# EAGLE design power (EAGLE 9.6.2)
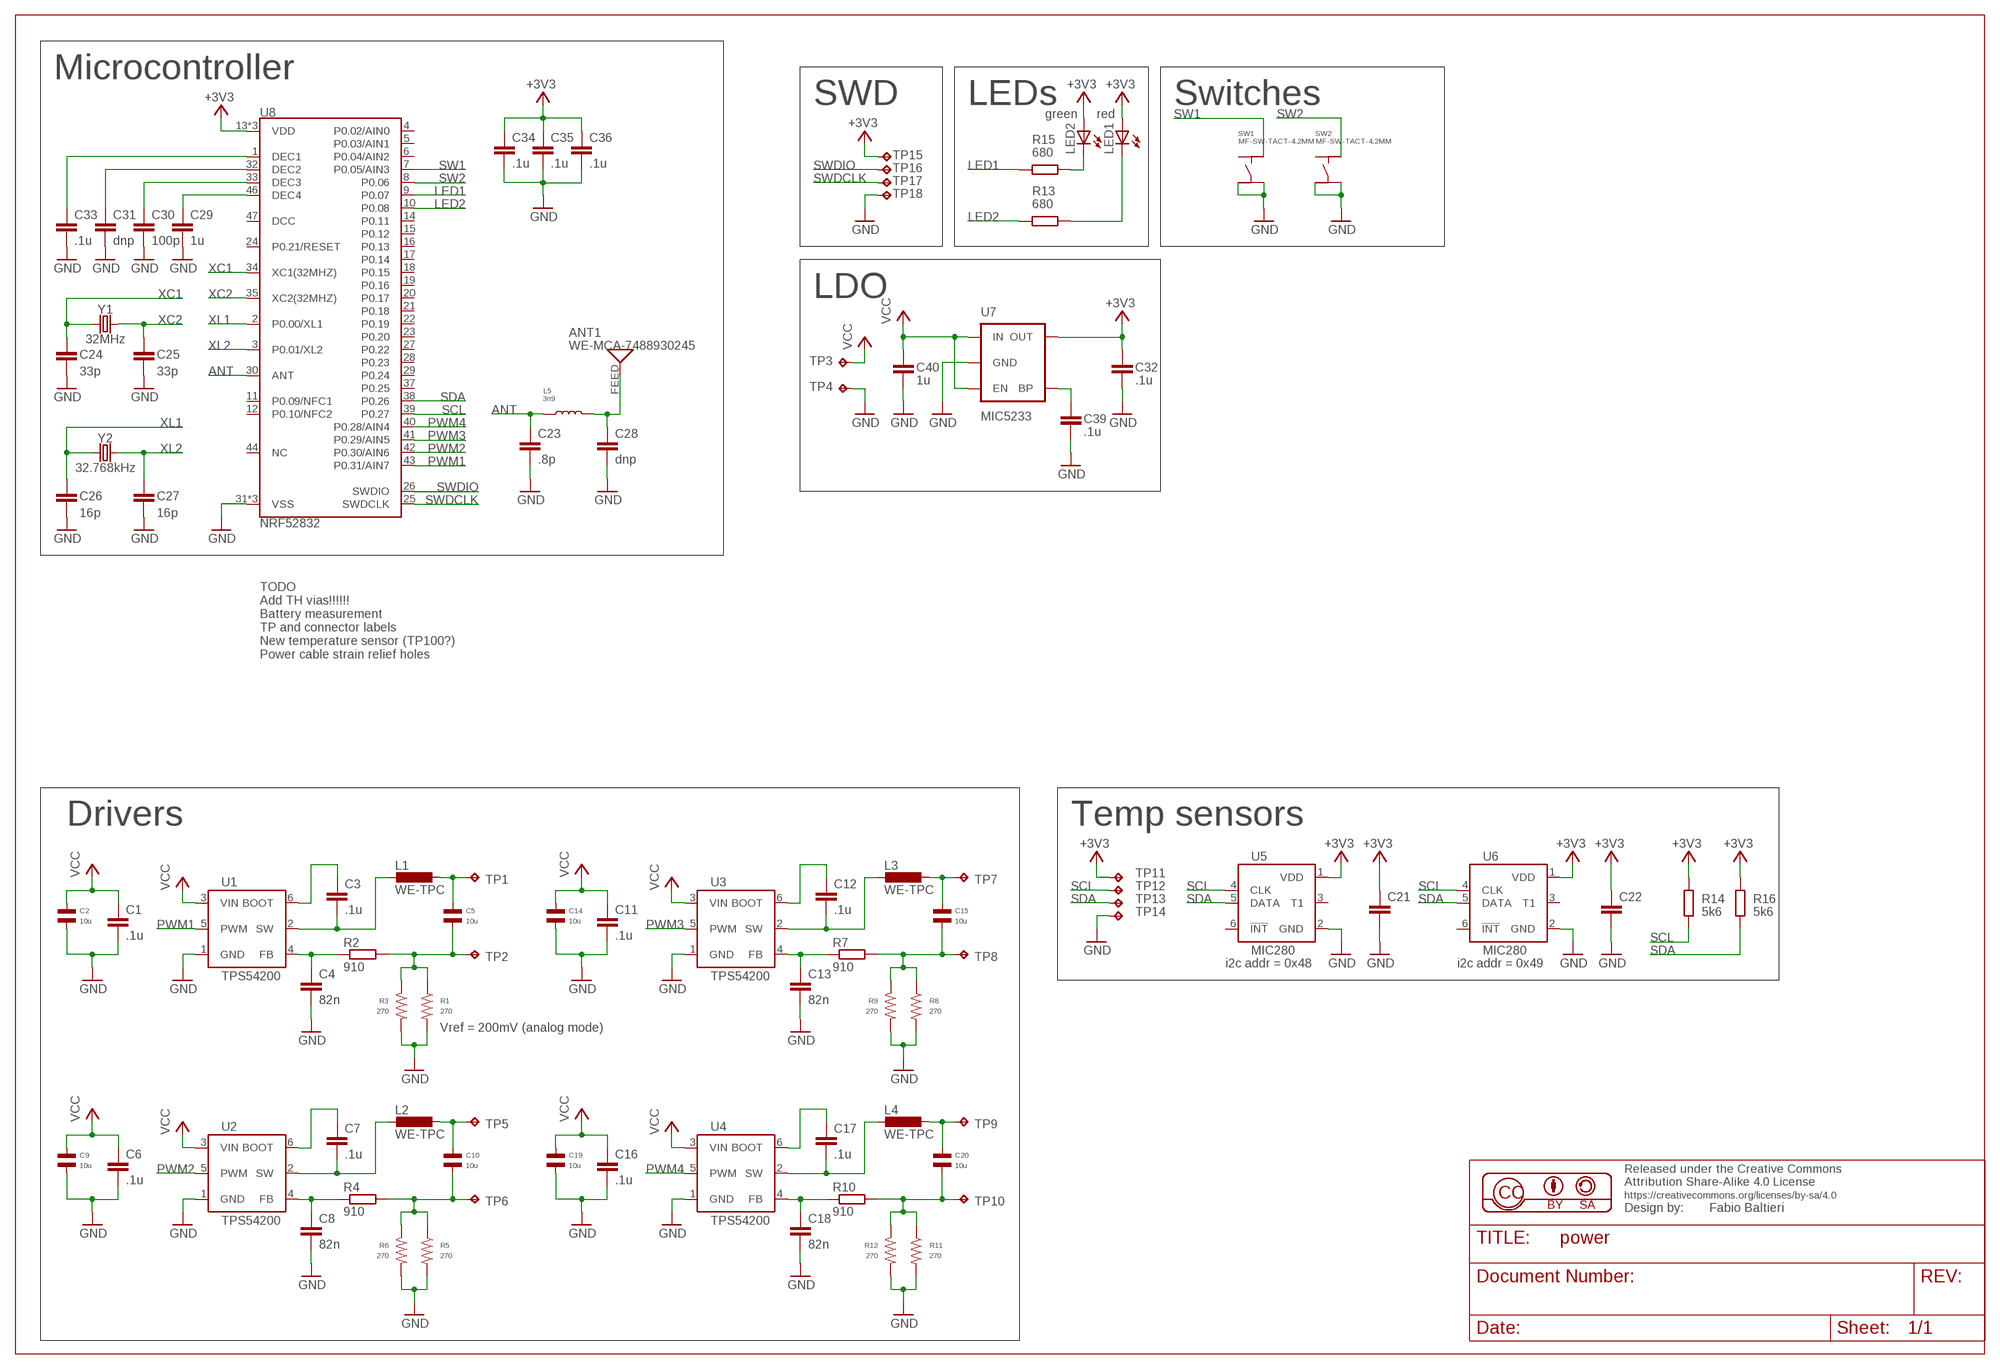
[diagram p0: schematic, sheet 1]

## Parts
ANT1  WE-MCA-7488930245  [WE-MCA]
C1  .1u  C0603  [0603]
C2  10u  CAPACITOR_NP_1206  [C1206]
C3  .1u  C0603  [0603]
C4  82n  C0603  [0603]
C5  10u  CAPACITOR_NP_1206  [C1206]
C6  .1u  C0603  [0603]
C7  .1u  C0603  [0603]
C8  82n  C0603  [0603]
C9  10u  CAPACITOR_NP_1206  [C1206]
C10  10u  CAPACITOR_NP_1206  [C1206]
C11  .1u  C0603  [0603]
C12  .1u  C0603  [0603]
C13  82n  C0603  [0603]
C14  10u  CAPACITOR_NP_1206  [C1206]
C15  10u  CAPACITOR_NP_1206  [C1206]
C16  .1u  C0603  [0603]
C17  .1u  C0603  [0603]
C18  82n  C0603  [0603]
C19  10u  CAPACITOR_NP_1206  [C1206]
C20  10u  CAPACITOR_NP_1206  [C1206]
C21  C0603  [0603]
C22  C0603  [0603]
C23  .8p  C0603  [0603]
C24  33p  C0603  [0603]
C25  33p  C0603  [0603]
C26  16p  C0603  [0603]
C27  16p  C0603  [0603]
C28  dnp  C0603  [0603]
C29  1u  C0603  [0603]
C30  100p  C0603  [0603]
C31  dnp  C0603  [0603]
C32  .1u  C0603  [0603]
C33  .1u  C0603  [0603]
C34  .1u  C0603  [0603]
C35  .1u  C0603  [0603]
C36  .1u  C0603  [0603]
C39  .1u  C0603  [0603]
C40  1u  C0603  [0603]
L1  WE-TPC  [WE-TPC_INDUCTOR]
L2  WE-TPC  [WE-TPC_INDUCTOR]
L3  WE-TPC  [WE-TPC_INDUCTOR]
L4  WE-TPC  [WE-TPC_INDUCTOR]
L5  3n9  INDUCTOR_0603  [L0603]
LED1  LEDSML0805  [SML0805]
LED2  LEDSML0805  [SML0805]
R1  270  RESISTOR_0805  [R0805]
R2  910  R0603  [0603]
R3  270  RESISTOR_0805  [R0805]
R4  910  R0603  [0603]
R5  270  RESISTOR_0805  [R0805]
R6  270  RESISTOR_0805  [R0805]
R7  910  R0603  [0603]
R8  270  RESISTOR_0805  [R0805]
R9  270  RESISTOR_0805  [R0805]
R10  910  R0603  [0603]
R11  270  RESISTOR_0805  [R0805]
R12  270  RESISTOR_0805  [R0805]
R13  680  R0603  [0603]
R14  5k6  R0603  [0603]
R15  680  R0603  [0603]
R16  5k6  R0603  [0603]
SW1  MF-SW-TACT-4.2MM  TACT_4.2MM  [TACT4.2MM]
SW2  MF-SW-TACT-4.2MM  TACT_4.2MM  [TACT4.2MM]
TP1  TPTP18R  [TP18R]
TP2  TPTP18R  [TP18R]
TP3  TPTP18R  [TP18R]
TP4  TPTP18R  [TP18R]
TP5  TPTP18R  [TP18R]
TP6  TPTP18R  [TP18R]
TP7  TPTP18R  [TP18R]
TP8  TPTP18R  [TP18R]
TP9  TPTP18R  [TP18R]
TP10  TPTP18R  [TP18R]
TP11  TPTP14R  [TP14R]
TP12  TPTP14R  [TP14R]
TP13  TPTP14R  [TP14R]
TP14  TPTP14R  [TP14R]
TP15  TPTP12R  [TP12R]
TP16  TPTP12R  [TP12R]
TP17  TPTP12R  [TP12R]
TP18  TPTP12R  [TP12R]
U1  TPS54200  [SOT23-6L]
U2  TPS54200  [SOT23-6L]
U3  TPS54200  [SOT23-6L]
U4  TPS54200  [SOT23-6L]
U5  MIC280  [SOT23-6L]
U6  MIC280  [SOT23-6L]
U7  MIC5233  V_REG_LDOSMD  [SOT23-5]
U8  NRF52832  [QFN48-6X6MM]
Y1  32MHz  CRYSTALSMD-3.2X2.5  [CRYSTAL-SMD-3.2X2.5MM]
Y2  32.768kHz  CRYSTAL-32.768KHZSMD-3.2X1.5  [CRYSTAL-SMD-3.2X1.5MM]

## Nets
+3V3: C21.1 C22.1 C32.1 C34.1 C35.1 C36.1 LED1.A LED2.A R14.1 R16.1 TP11.TP TP15.TP U5.1(VDD) U6.1(VDD) U7.5(OUT) U8.13(VDD) U8.36(VDD) U8.48(VDD)
ANT: C23.1 L5.P$1 U8.30(ANT)
GND: C1.2 C2.P$2 C4.2 C6.2 C8.2 C9.P$2 C11.2 C13.2 C14.P$2 C16.2 C18.2 C19.P$2 C21.2 C22.2 C23.2 C24.2 C25.2 C26.2 C27.2 C28.2 C29.2 C30.2 C31.2 C32.2 C33.2 C34.2 C35.2 C36.2 C39.2 C40.2 R1.P$2 R3.P$2 R5.P$2 R6.P$2 R8.P$2 R9.P$2 R11.P$2 R12.P$2 SW1.P$3 SW1.P$4 SW2.P$3 SW2.P$4 TP4.TP TP14.TP TP18.TP U1.1(GND) U2.1(GND) U3.1(GND) U4.1(GND) U5.2(GND) U6.2(GND) U7.2(GND) U8.31(VSS) U8.45(VSS) U8.EP(VSS)
LED1: R15.2 U8.9(P0.07)
LED2: R13.2 U8.10(P0.08)
N$1: C3.2 L1.P$1 U1.2(SW)
N$2: C3.1 U1.6(BOOT)
N$3: C5.P$1 L1.P$2 TP1.TP
N$4: C4.1 R2.1 U1.4(FB)
N$5: C5.P$2 R1.P$1 R2.2 R3.P$1 TP2.TP
N$6: C7.2 L2.P$1 U2.2(SW)
N$7: C7.1 U2.6(BOOT)
N$8: C8.1 R4.1 U2.4(FB)
N$9: C10.P$2 R4.2 R5.P$1 R6.P$1 TP6.TP
N$10: C10.P$1 L2.P$2 TP5.TP
N$11: C12.2 L3.P$1 U3.2(SW)
N$12: C12.1 U3.6(BOOT)
N$13: C13.1 R7.1 U3.4(FB)
N$14: C15.P$2 R7.2 R8.P$1 R9.P$1 TP8.TP
N$15: C15.P$1 L3.P$2 TP7.TP
N$16: C17.2 L4.P$1 U4.2(SW)
N$17: C17.1 U4.6(BOOT)
N$18: C18.1 R10.1 U4.4(FB)
N$19: C20.P$2 R10.2 R11.P$1 R12.P$1 TP10.TP
N$20: C20.P$1 L4.P$2 TP9.TP
N$21: LED1.C R13.1
N$22: ANT1.FEED C28.1 L5.P$2
N$23: LED2.C R15.1
N$24: C29.1 U8.46(DEC4)
N$25: C30.1 U8.33(DEC3)
N$26: C31.1 U8.32(DEC2)
N$27: C33.1 U8.1(DEC1)
N$30: C39.1 U7.4(BP)
PWM1: U1.5(PWM) U8.43(P0.31/AIN7)
PWM2: U2.5(PWM) U8.42(P0.30/AIN6)
PWM3: U3.5(PWM) U8.41(P0.29/AIN5)
PWM4: U4.5(PWM) U8.40(P0.28/AIN4)
SCL: R14.2 TP12.TP U5.4(CLK) U6.4(CLK) U8.39(P0.27)
SDA: R16.2 TP13.TP U5.5(DATA) U6.5(DATA) U8.38(P0.26)
SW1: SW1.P$2 U8.7(P0.05/AIN3)
SW2: SW2.P$2 U8.8(P0.06)
SWDCLK: TP17.TP U8.25(SWDCLK)
SWDIO: TP16.TP U8.26(SWDIO)
VCC: C1.1 C2.P$1 C6.1 C9.P$1 C11.1 C14.P$1 C16.1 C19.P$1 C40.1 TP3.TP U1.3(VIN) U2.3(VIN) U3.3(VIN) U4.3(VIN) U7.1(IN) U7.3(EN)
XC1: C24.1 U8.34(XC1(32MHZ)) Y1.1
XC2: C25.1 U8.35(XC2(32MHZ)) Y1.3
XL1: C26.1 U8.2(P0.00/XL1) Y2.P$1
XL2: C27.1 U8.3(P0.01/XL2) Y2.P$2
Unconnected: SW1.P$1 SW2.P$1 U5.3(T1) U5.6(!INT) U6.3(T1) U6.6(!INT) U8.4(P0.02/AIN0) U8.5(P0.03/AIN1) U8.6(P0.04/AIN2) U8.11(P0.09/NFC1) U8.12(P0.10/NFC2) U8.14(P0.11) U8.15(P0.12) U8.16(P0.13) U8.17(P0.14) U8.18(P0.15) U8.19(P0.16) U8.20(P0.17) U8.21(P0.18) U8.22(P0.19) U8.23(P0.20) U8.24(P0.21/RESET) U8.27(P0.22) U8.28(P0.23) U8.29(P0.24) U8.37(P0.25) U8.44(NC) U8.47(DCC)

## Notes on the sheet
- Microcontroller
- SWD | LEDs | Switches
- green | red
- LDO
- TODO
  Add TH vias!!!!!!
  Battery measurement
  TP and connector labels
  New temperature sensor (TP100?)
  Power cable strain relief holes
- Drivers | Temp sensors
- i2c addr = 0x48 | i2c addr = 0x49
- Vref = 200mV (analog mode)

## Library data of the parts
ANT1 = balto:WE-MCA: Wurth WE-MCA Multilayer Chip Antenna
C1 C3 C4 C6-C8 C11-C13 C16-C18 C21-C36 C39 C40 = balto:C: Capacitor
C2 C5 C9 C10 C14 C15 C19 C20 = MF_Passives:CAPACITOR_NP: Library: MF_Passives Description: Device for Non-Polarized Capacitors. Manufacture part number (MPN) can be added via Attributes. Check https://factory.macrofab.com/parts for the house parts list.; POPULATE: 1
L1-L4 = balto:WE-TPC: WE-TPC SMD Shielded Tiny PowerInductor
L5 = MF_Passives:INDUCTOR: Library: MF_Passives Description: Device for Inductors. Manufacture part number (MPN) can be added via Attributes. Check https://factory.macrofab.com/parts for the house parts list.; POPULATE: 1
LED1 LED2 = led:LED: LED OSRAM: - CHIPLED LG R971, LG N971, LY N971, LG Q971, LY Q971, LO R971, LY R971 LH N974, LH R974 LS Q976, LO Q976, LY Q976 LO Q996 - Hyper CHIPLED LW Q18S LB Q993, LB Q99A, LB R99A - SideLED LS A670, LO A670, LY A670, LG A670, LP A670 LB A673, LV A673, LT A673, LW A673 LH A674 LY A675 LS A676, LA A676, LO A676, LY A676, LW A676 LS A679, LY A679, LG A679 - Hyper Micro SIDELED® LS Y876, LA Y876, LO Y876, LY Y876 LT Y87S - SmartLED LW L88C, LW L88S LB L89C, LB L89S, LG L890 LS L89K, LO L89K, LY L89K LS L896, LA L896, LO L896, LY L896 - TOPLED LS T670, LO T670, LY T670, LG T670, LP T670 LSG T670, LSP T670, LSY T670, LOP T670, LYG T670 LG T671, LOG T671, LSG T671 LB T673, LV T673, LT T673, LW T673 LH T674 LS T676, LA T676, LO T676, LY T676, LB T676, LH T676, LSB T676, LW T676 LB T67C, LV T67C, LT T67C, LS T67K, LO T67K, LY T67K, LW E67C LS E67B, LA E67B, LO E67B, LY E67B, LB E67C, LV E67C, LT E67C LW T67C LS T679, LY T679, LG T679 LS T770, LO T770, LY T770, LG T770, LP T770 LB T773, LV T773, LT T773, LW T773 LH T774 LS E675, LA E675, LY E675, LS T675 LS T776, LA T776, LO T776, LY T776, LB T776 LHGB T686 LT T68C, LB T68C - Hyper Mini TOPLED® LB M676 - Mini TOPLED Santana® LG M470 LS M47K, LO M47K, LY M47K Source: http://www.osram.convergy.de LUXEON: - LUMILED® LXK2-PW12-R00, LXK2-PW12-S00, LXK2-PW14-U00, LXK2-PW14-V00 LXK2-PM12-R00, LXK2-PM12-S00, LXK2-PM14-U00 LXK2-PE12-Q00, LXK2-PE12-R00, LXK2-PE12-S00, LXK2-PE14-T00, LXK2-PE14-U00 LXK2-PB12-K00, LXK2-PB12-L00, LXK2-PB12-M00, LXK2-PB14-N00, LXK2-PB14-P00, LXK2-PB14-Q00 LXK2-PR12-L00, LXK2-PR12-M00, LXK2-PR14-Q00, LXK2-PR14-R00 LXK2-PD12-Q00, LXK2-PD12-R00, LXK2-PD12-S00 LXK2-PH12-R00, LXK2-PH12-S00 LXK2-PL12-P00, LXK2-PL12-Q00, LXK2-PL12-R00 Source: www.luxeon.com KINGBRIGHT: KA-3528ASYC Source: www.kingbright.com
R1 R3 R5 R6 R8 R9 R11 R12 = MF_Passives:RESISTOR: Library: MF_Passives Description: Device for Resistors. Manufacture part number (MPN), Voltage, Tolerance, and Wattage Rating can be added via Attributes. Check https://factory.macrofab.com/parts for the house parts list.; POPULATE: 1
R2 R4 R7 R10 R13-R16 = balto:R: Resistor
SW1 SW2 = MF_Switches:TACT: Library: MF_Switches Description: Device for Tact Switches. Manufacture part number (MFG#) can be added via Attributes.; HOUSEPART: YES; MPN: MF-SW-TACT-4.2MM; POPULATE: 1; URL: https://factory.macrofab.com/part/MF-SW-TACT-4.2MM
TP1-TP18 = testpad:TP: Test pad
U1-U4 = balto:TPS54200: TPS54200, TPS54201 4.5-V to 28-V Input Voltage, 1.5-A Output Current, Synchronous Buck Mono-Color or IR LED Driver http://www.ti.com/lit/ds/symlink/tps54201.pdf
U5 U6 = balto:MIC280: MIC280 Precision IttyBitty Thermal Supervisor
U7 = SparkFun-PowerIC:V_REG_LDO: Voltage Regulator LDO Standard 150mA LDO voltage regulator in SOT-23 layout. Micrel part MIC5205. BP (by-pass) pin is used to lower output noise with 470pF cap.
U8 = SparkFun-RF:NRF52832: Nordic nRF52832 Bluetooth Smart/ANT/2.4GHz RF SoC The nRF52832 SoC is a powerful, highly flexible ultra-low power multiprotocol SoC ideally suited for Bluetooth® Smart ANT and 2.4GHz ultra low-power wireless applications. The nRF52832 SoC is built around a 32-bit ARM® Cortex™-M4F CPU with 512kB + 64kB RAM. The embedded 2.4GHz transceiver supports Bluetooth Smart, ANT and proprietary 2.4 GHz protocol stack. It is on air compatible with the nRF51 Series, nRF24L and nRF24AP Series products from Nordic Semiconductor. Datasheet <https://cdn.sparkfun.com/datasheets/Wireless/Bluetooth/nRF52832_PS_v1.0.pdf> SparkFun Products: SparkFun nRF52832 Breakout <https://www.sparkfun.com/products/13990>; PROD_ID: IC-13460
Y1 = SparkFun-Clocks:CRYSTAL: Crystals (Generic) These are passive quartz crystals, which can be used as a clock source for a microcontroller. Crystal's are two-terminal devices. They require external "load" capacitors to generate an oscillating signal.
Y2 = SparkFun-Clocks:CRYSTAL-32.768KHZ: 32.768kHz Crystal Frequency: 32.768kHz Frequency Stability: ±20ppm Load Capacitance: 12.5pF (PTH-2X6 & SMD-3.2X1.5), 6pF (SMD-2X6) SparkFun Products: SparkFun BigTime Watch Kit <https://www.sparkfun.com/products/11734> SparkFun nRF52832 Breakout <https://www.sparkfun.com/products/13990> SparkFun Real Time Clock Module <https://www.sparkfun.com/products/12708>; PROD_ID: XTAL-13062

## Board
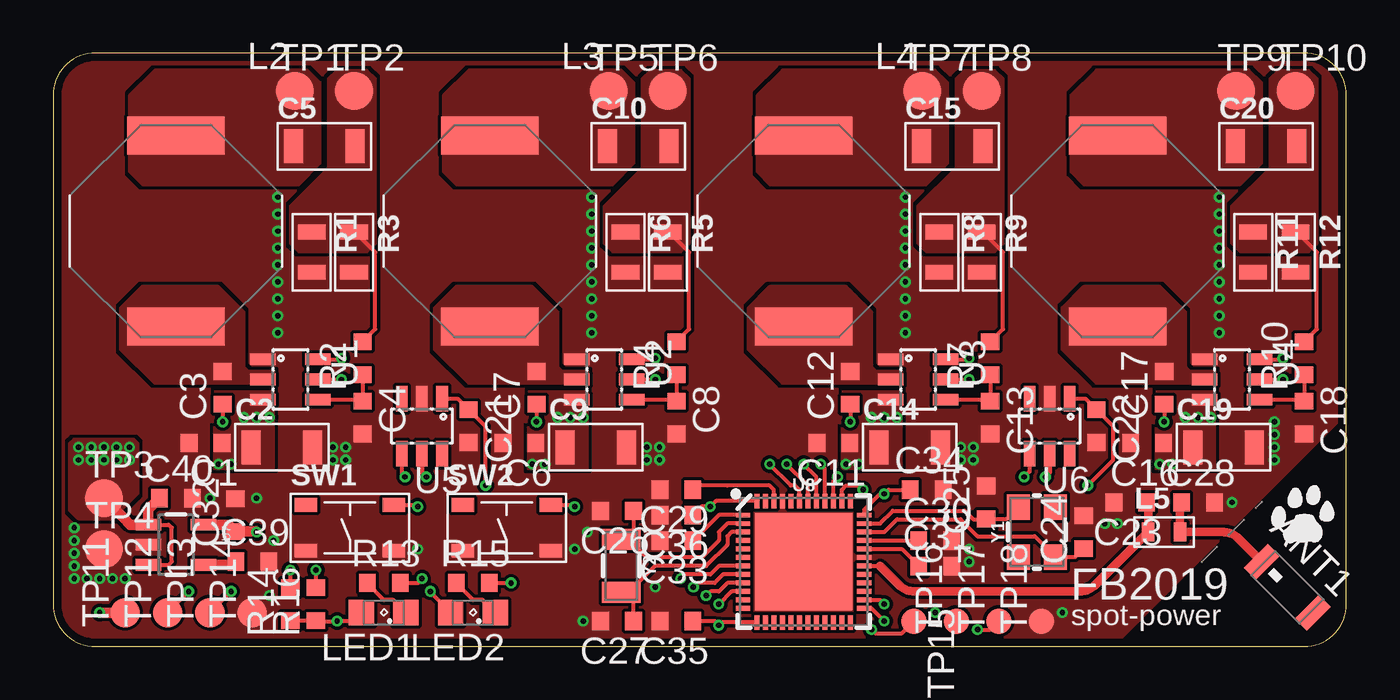
[diagram p1: board, top side]
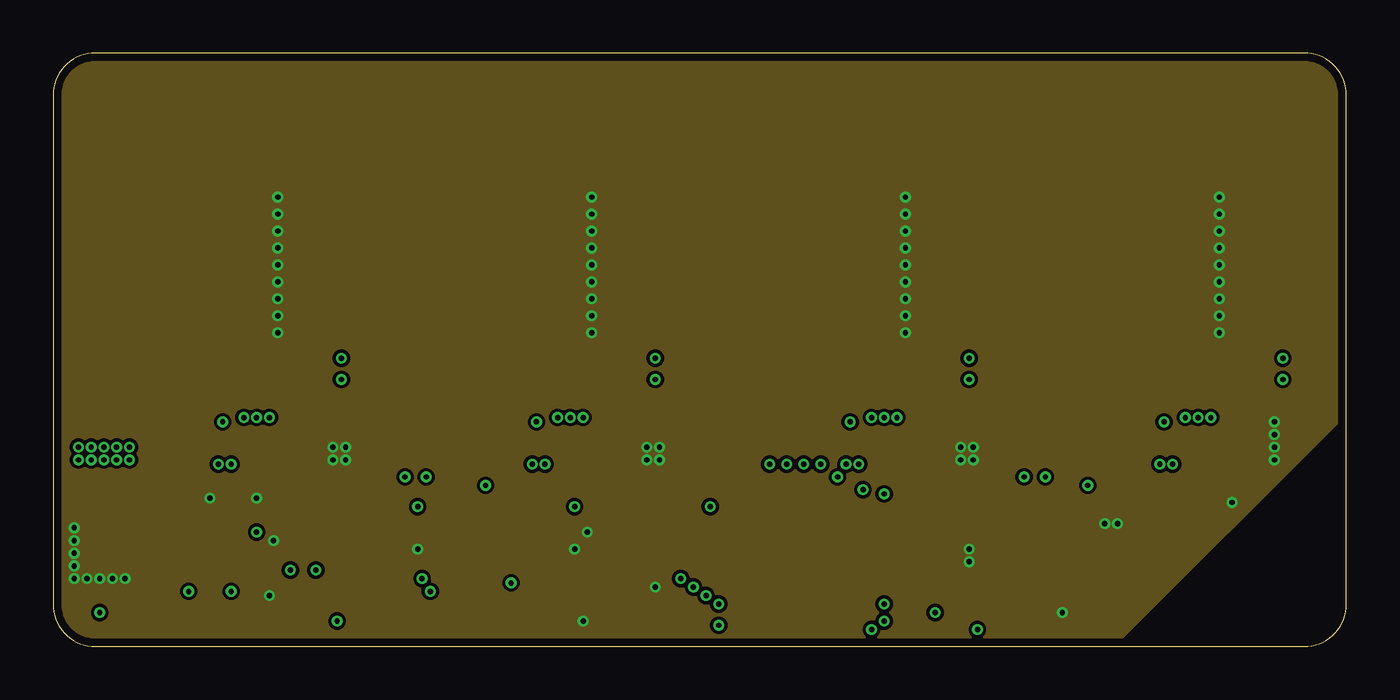
[diagram p2: board, inner layer Route2]
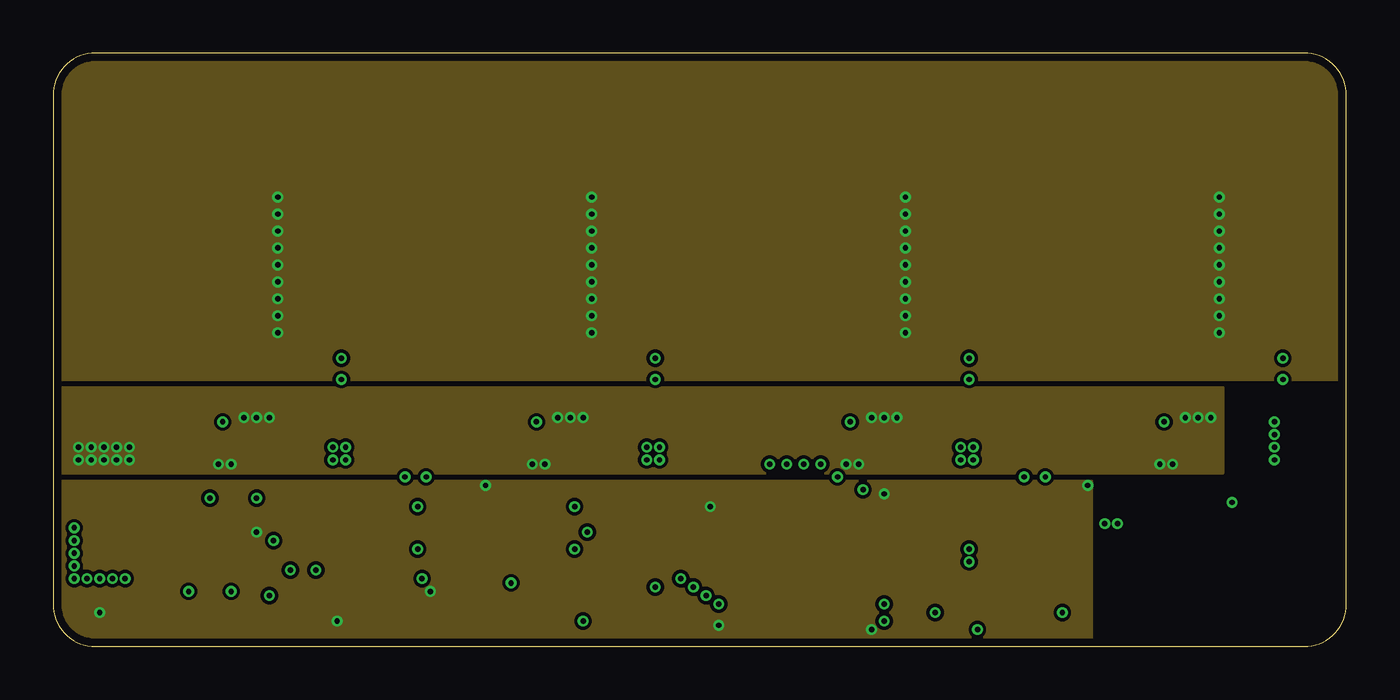
[diagram p3: board, inner layer Route15]
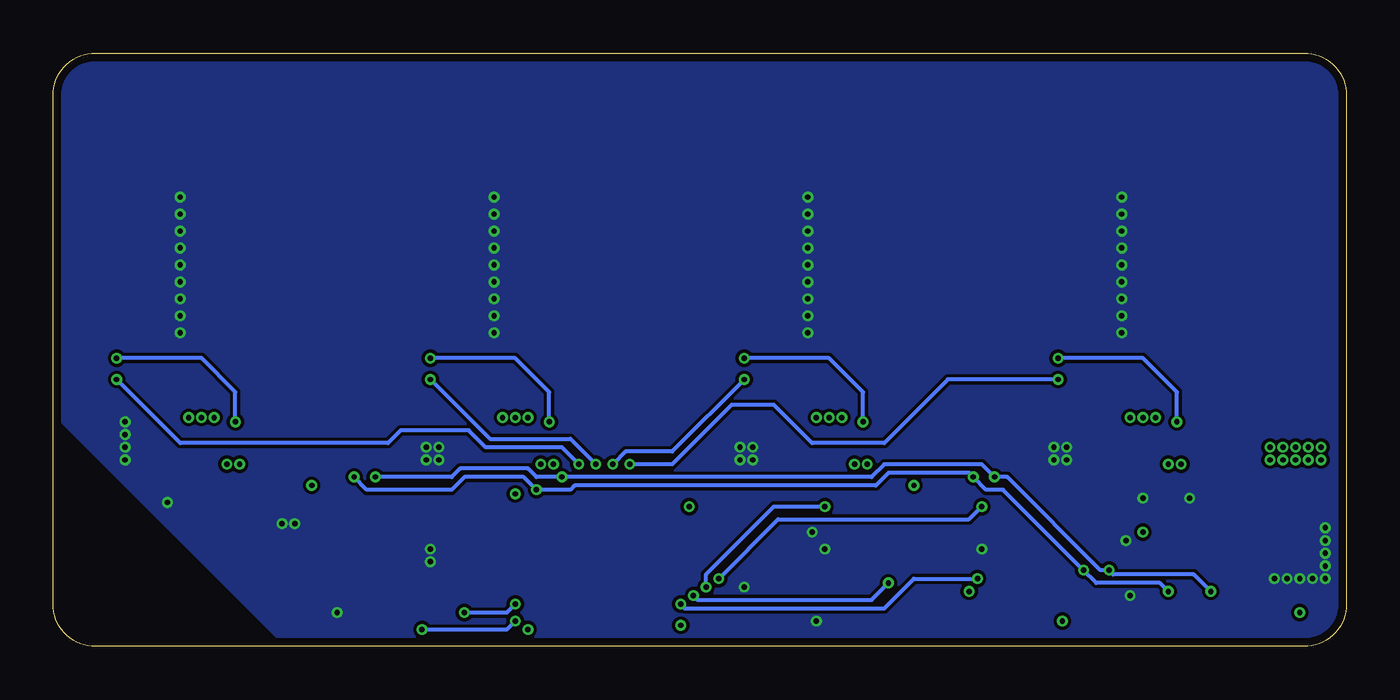
[diagram p4: board, bottom side, seen from below]

Size 61 x 28 mm. Coordinates in mm from the lower left corner, seen from the top.
Outline: 59,28 2,28 arc90 0,26 0,2 arc90 2,0 59,0 arc90 61,2 61,26 arc90 59,28
Copper layers (1*2+15*16): Top 0.035mm / dielectric 1.5mm / Route2 0.035mm / dielectric 0.15mm / Route15 0.035mm / dielectric 0.2mm / Bottom 0.035mm
Design rules "balto": minimum track width 6mil, minimum drill 10mil, track to track 6mil, track to pad 6mil, pad to pad 6mil, via to via 6mil, smd to smd 6mil, copper to edge 15mil, drill to drill 5mil, minimum pad ring 5mil, minimum via ring 5mil, stop-mask expansion 2mil, vias tented up to drill 20mil, thermal gap 8mil

### Footprints (pad centres in the part's own frame; a part is rotated, then mirrored left to right if it is on the bottom)
WE-MCA = smd 0.8 x 1.6: FEED -1.7,0; NC 1.7,0
0603 = smd 0.787 x 0.864: 1 -0.774,0; 2 0.774,0
C1206 = smd 0.9 x 1.6: P$1 -1.45,0; P$2 1.45,0
WE-TPC_INDUCTOR = smd 4.6 x 1.8: P$1 0,-4.5; P$2 0,4.5
L0603 = smd 0.6 x 0.9: P$1 -0.75,0; P$2 0.75,0
SML0805 = smd 1.2 x 1.2: A 1.05,0; C -1.05,0
R0805 = smd 0.7 x 1.3: P$1 -0.95,0; P$2 0.95,0
TACT4.2MM = smd 1.05 x 0.65: P$1 -2.075,1.075; P$2 2.075,1.075; P$3 -2.075,-1.075; P$4 2.075,-1.075
TP18R = smd 1.8 x 1.8: TP 0,0
TP14R = smd 1.4 x 1.4: TP 0,0
TP12R = smd 1.2 x 1.2: TP 0,0
SOT23-6L = smd 0.55 x 1.2: 1 -0.95,-1.3; 2 0,-1.3; 3 0.95,-1.3; 4 0.95,1.3; 5 0,1.3; 6 -0.95,1.3
SOT23-5 = smd 0.55 x 1.2: 1 -0.95,-1.3; 2 0,-1.3; 3 0.95,-1.3; 4 0.95,1.3; 5 -0.95,1.3
QFN48-6X6MM = smd 0.68 x 0.23: 1 -2.86,2.2; 2 -2.86,1.8; 3 -2.86,1.4; 4 -2.86,1; 5 -2.86,0.6; 6 -2.86,0.2; 7 -2.86,-0.2; 8 -2.86,-0.6; 9 -2.86,-1; 10 -2.86,-1.4; 11 -2.86,-1.8; 12 -2.86,-2.2; 25 2.86,-2.2; 26 2.86,-1.8; 27 2.86,-1.4; 28 2.86,-1; 29 2.86,-0.6; 30 2.86,-0.2; 31 2.86,0.2; 32 2.86,0.6; 33 2.86,1; 34 2.86,1.4; 35 2.86,1.8; 36 2.86,2.2 | smd 0.23 x 0.68: 13 -2.2,-2.86; 14 -1.8,-2.86; 15 -1.4,-2.86; 16 -1,-2.86; 17 -0.6,-2.86; 18 -0.2,-2.86; 19 0.2,-2.86; 20 0.6,-2.86; 21 1,-2.86; 22 1.4,-2.86; 23 1.8,-2.86; 24 2.2,-2.86; 37 2.2,2.86; 38 1.8,2.86; 39 1.4,2.86; 40 1,2.86; 41 0.6,2.86; 42 0.2,2.86; 43 -0.2,2.86; 44 -0.6,2.86; 45 -1,2.86; 46 -1.4,2.86; 47 -1.8,2.86; 48 -2.2,2.86 | smd 4.6 x 4.6: EP 0,0
CRYSTAL-SMD-3.2X2.5MM = smd 1.2 x 1.1: 1 -1.175,-0.875; 2 1.175,-0.875; 3 1.175,0.875; 4 -1.175,0.875
CRYSTAL-SMD-3.2X1.5MM = smd 1 x 1.8: P$1 -1.25,0; P$2 1.25,0

### Placement (x,y rotation side)
ANT1  58.2,2.8 315 top
C1  7.2,9.6 180 top
C2  10.8,9.4 0 top
C3  8,12.2 90 top
C4  14.6,10.8 270 top
C5  12.8,23.6 0 top
C6  22,9.6 180 top
C7  22.8,12.2 90 top
C8  29.4,10.8 270 top
C9  25.6,9.4 0 top
C10  27.6,23.6 0 top
C11  36.8,9.6 180 top
C12  37.6,12.2 90 top
C13  44.2,10.8 270 top
C14  40.4,9.4 0 top
C15  42.4,23.6 0 top
C16  51.6,9.6 180 top
C17  52.4,12.2 90 top
C18  59,10.8 270 top
C19  55.2,9.4 0 top
C20  57.2,23.6 0 top
C21  19.6,10.4 270 top
C22  49.2,10.4 270 top
C23  50.8,6.8 180 top
C24  48.6,5.4 90 top
C25  44,6.8 90 top
C26  26.6,6.4 180 top
C27  26.6,1.2 180 top
C28  54,6.8 0 top
C29  29.4,7.4 180 top
C30  41.6,5 0 top
C31  41.6,3.8 0 top
C32  8.6,6.2 90 top
C33  29.4,5 180 top
C34  41.2,7.4 0 top
C35  29.4,1.2 180 top
C36  29.4,6.2 180 top
C39  9.4,4 0 top
C40  5.8,7 0 top
L1  5.8,19.6 0 top
L2  20.6,19.6 0 top
L3  35.4,19.6 0 top
L4  50.2,19.6 0 top
L5  52.4,5.4 0 top
LED1  15.6,1.6 180 top
LED2  19.8,1.6 180 top
R1  12.2,18.6 270 top
R2  14.6,13.6 90 top
R3  14.2,18.6 270 top
R4  29.4,13.6 90 top
R5  29,18.6 270 top
R6  27,18.6 270 top
R7  44.2,13.6 90 top
R8  41.8,18.6 270 top
R9  43.8,18.6 270 top
R10  59,13.6 90 top
R11  56.6,18.6 270 top
R12  58.6,18.6 270 top
R13  15.6,3 0 top
R14  11.2,2 90 top
R15  19.8,3 0 top
R16  12.4,2 90 top
SW1  14,5.6 0 top
SW2  21.4,5.6 0 top
TP1  11.4,26.2 0 top
TP2  14.2,26.2 0 top
TP3  2.4,7 0 top
TP4  2.4,4.6 0 top
TP5  26.2,26.2 0 top
TP6  29,26.2 0 top
TP7  41,26.2 0 top
TP8  43.8,26.2 0 top
TP9  55.8,26.2 0 top
TP10  58.6,26.2 0 top
TP11  3.4,1.6 90 top
TP12  5.4,1.6 90 top
TP13  7.4,1.6 90 top
TP14  9.4,1.6 90 top
TP15  40.6,1.2 270 top
TP16  42.6,1.2 90 top
TP17  44.6,1.2 90 top
TP18  46.6,1.2 90 top
U1  11.2,12.6 270 top
U2  26,12.6 270 top
U3  40.8,12.6 270 top
U4  55.6,12.6 270 top
U5  17.4,10.4 180 top
U6  47,10.4 180 top
U7  5.8,4.8 270 top
U8  35.4,4 0 top
U$1  [CAT-L]  59,5.8 0 top
Y1  46.4,5.4 90 top
Y2  26.8,3.8 270 top

### Tracks (layer width: path | path; a pad name or v marks a point on that pad's centre or on a via)
+3V3  (via drill 0.25)
  Top 0.2: U8.48 31.26,6.86 v31,6.6 30.57,6.6 C36.1 | U8.13 31.54,1.14 v31.4,1 31.2,1.2 C35.1 | C34.1 39.4,7.4 v39.2,7.2 39,7.2 38.26,6.46 U8.36 | TP15.TP 40,0.6 38.8,0.6 v38.6,0.8 | R14.1 R16.1 12.43,1.2 v13.4,1.2 14.15,1.2 LED1.A | LED2.A 17.8,2.55 v17.8,2.6 | v20.4,7.6 20.4,10.37 C21.1 19.07,11.7 U5.1 | U6.1 48.67,11.7 C22.1 50,10.37 50,8.8 v48.8,7.6
  Top 0.5: U7.5 8.28,5.75 C32.1 9.57,5.43 v9.6,5.4 | TP11.TP v2.2,1.6
  pour Route15: -3,-3 49,-3 49,7.8 -3,7.8
ANT
  Top 0.2: U8.30 39,3.8
  Top 0.4: 39,3.8 39.91,2.89 arc45 40.61,2.6 48.44,2.6 arc45 49.14,2.89 L5.P$1 51.65,6.72 C23.1
GND  (via drill 0.25)
  other vias: 13.8,9.4 13.8,8.8 13.2,9.4 13.2,8.8 10.6,14.8 10.6,15.6 10.6,16.4 10.6,17.2 10.6,18 10.6,18.8 10.6,19.6 10.6,20.4 10.6,21.2 28.6,9.4 28.6,8.8 28,9.4 28,8.8 25.4,14.8 25.4,15.6 25.4,16.4 25.4,17.2 25.4,18 25.4,18.8 25.4,19.6 25.4,20.4 25.4,21.2 43.4,8.8 43.4,9.4 42.8,9.4 42.8,8.8 40.2,14.8 40.2,15.6 40.2,16.4 40.2,17.2 40.2,18 40.2,18.8 40.2,19.6 40.2,20.4 40.2,21.2 57.6,10.6 57.6,10 57.6,9.4 57.6,8.8 55,14.8 55,15.6 55,16.4 55,17.2 55,18 55,18.8 55,19.6 55,20.4 55,21.2 1,5 1,4.4 1,3.8 2.2,3.2 1.6,3.2 2.8,3.2 1,3.2 1,5.6 3.4,3.2 9.6,7 10.4,5 17.2,4.6 24.6,4.6 7.4,7 10.2,2.4 25,1.2 28.4,2.8 25.2,5.4 43.2,4.6 43.2,4 49.6,5.8 50.2,5.8 55.6,6.8 47.6,1.6
  pour Top (rank 2, no thermals): -1,-1 49,-1 62,12 62,29 -1,29
  pour Bottom: -2,-2 48,-2 62.41,12.41 arc45 63,13.83 63,30 -2,30
  pour Route15: -3,12.6 63.8,12.6 63.8,30.8 -3,30.8
  pour Route2: -4,-4 46,-4 64.8,14.8 64.8,31.8 -4,31.8
LED1  (via drill 0.25)
  Top 0.2: U8.9 31.8,3 31.4,2.6 31,2.6 v30.8,2.4 | R15.2 v21.6,3
  Bottom 0.2: v30.8,2.4 30.6,2.2 22.4,2.2 v21.6,3
LED2  (via drill 0.25)
  Top 0.2: U8.10 32,2.6 v31.4,2 | R13.2 17.2,3 v17.4,3.2
  Bottom 0.2: v31.4,2 31.2,1.8 21.8,1.8 20.4,3.2 v17.4,3.2
N$1
  pour Top (no thermals): 10,12.4 4.8,12.4 3.2,14 3.2,16 4.2,17 7.8,17 8.4,16.4 9,15.8 9,13.2 9.2,13 10.4,13 10.4,12.4
N$2  (via drill 0.25)
  Top 0.2: U1.6 13.55,13.55 v13.6,13.6 | C3.1 v8,10.6
  Bottom 0.2: v13.6,13.6 9.6,13.6 8,12 v8,10.6
N$3
  pour Top (no thermals): 4.2,21.8 11.6,21.8 12.6,22.8 12.6,26.6 12,27.2 4.8,27.2 3.6,26 3.6,22.4
N$4
  Top 0.2: 14.52,11.65 14.59,11.59 | 14.59,11.59 C4.1 14.52,11.65 | R2.1 14.6,11.6 14.59,11.59 | U1.4 14.52,11.65
N$5
  Top 0.2: R2.2 15.2,14.97 15.2,18.6 14.25,19.55 R3.P$1
  pour Top (no thermals): 13,26.8 13.4,27.2 14.8,27.2 15.2,26.8 15.2,19 14.8,18.6 11.6,18.6 11.2,19 11.2,20.8 13,22.6
N$6
  pour Top (no thermals): 24.8,12.4 19.6,12.4 18,14 18,16 19,17 22.6,17 23.2,16.4 23.8,15.8 23.8,13.2 24,13 25.2,13 25.2,12.4
N$7  (via drill 0.25)
  Top 0.2: U2.6 28.35,13.55 v28.4,13.6 | C7.1 v22.8,10.6
  Bottom 0.2: v28.4,13.6 24.4,13.6 22.8,12 v22.8,10.6
N$8
  Top 0.2: U2.4 29.32,11.65 29.39,11.59 | 29.39,11.59 C8.1 | R4.1 29.4,11.6 29.39,11.59
N$9
  Top 0.2: R4.2 30,14.97 30,18.6 29.05,19.55 R5.P$1
  pour Top (no thermals): 27.8,26.8 28.2,27.2 29.6,27.2 30,26.8 30,19 29.6,18.6 26.4,18.6 26,19 26,20.8 27.8,22.6
N$10
  pour Top (no thermals): 19,21.8 26.4,21.8 27.4,22.8 27.4,26.6 26.8,27.2 19.6,27.2 18.4,26 18.4,22.4
N$11
  pour Top (no thermals): 39.6,12.4 34.4,12.4 32.8,14 32.8,16 33.8,17 37.4,17 38,16.4 38.6,15.8 38.6,13.2 38.8,13 40,13 40,12.4
N$12  (via drill 0.25)
  Top 0.2: U3.6 43.15,13.55 v43.2,13.6 | C12.1 v37.6,10.6
  Bottom 0.2: v43.2,13.6 39.2,13.6 37.6,12 v37.6,10.6
N$13
  Top 0.2: U3.4 44.12,11.65 44.19,11.59 | 44.19,11.59 C13.1 | R7.1 44.2,11.6 44.19,11.59
N$14
  Top 0.2: R7.2 44.8,14.97 44.8,18.6 43.85,19.55 R9.P$1
  pour Top (no thermals): 42.6,26.8 43,27.2 44.4,27.2 44.8,26.8 44.8,19 44.4,18.6 41.2,18.6 40.8,19 40.8,20.8 42.6,22.6
N$15
  pour Top (no thermals): 33.8,21.8 41.2,21.8 42.2,22.8 42.2,26.6 41.6,27.2 34.4,27.2 33.2,26 33.2,22.4
N$16
  pour Top (no thermals): 54.4,12.4 49.2,12.4 47.6,14 47.6,16 48.6,17 52.2,17 52.8,16.4 53.4,15.8 53.4,13.2 53.6,13 54.8,13 54.8,12.4
N$17  (via drill 0.25)
  Top 0.2: U4.6 57.95,13.55 v58,13.6 | C17.1 v52.4,10.6
  Bottom 0.2: v58,13.6 54,13.6 52.4,12 v52.4,10.6
N$18
  Top 0.2: U4.4 58.92,11.65 58.99,11.59 | 58.99,11.59 C18.1 | R10.1 59,11.6 58.99,11.59
N$19
  Top 0.2: R10.2 59.6,14.97 59.6,18.6 58.65,19.55 R12.P$1
  pour Top (no thermals): 57.4,26.8 57.8,27.2 59.2,27.2 59.6,26.8 59.6,19 59.2,18.6 56,18.6 55.6,19 55.6,20.8 57.4,22.6
N$20
  pour Top (no thermals): 48.6,21.8 56,21.8 57,22.8 57,26.6 56.4,27.2 49.2,27.2 48,26 48,22.4
N$21
  Top 0.2: LED1.C 16.05,2.2 15.6,2.2 14.82,2.97 R13.1
N$22
  Top 0.4: C28.1 53.15,6.72 L5.P$2 55.19,5.4 arc-45 55.89,5.11 ANT1.FEED
N$23
  Top 0.2: LED2.C 20.25,2.2 19.8,2.2 19.03,2.97 R15.1
N$24
  Top 0.2: U8.46 34,7.4 33.8,7.6 31.8,7.6 30.4,7.6 30.2,7.4 C29.1
N$25
  Top 0.2: U8.33 C30.1
N$26
  Top 0.2: U8.32 40.03,4.6 C31.1
N$27
  Top 0.2: U8.1 31.4,6.2 30.2,5 C33.1
N$30
  Top 0.5: U7.4 8.48,3.85 C39.1
PWM1  (via drill 0.25)
  Top 0.2: U1.5 v13.6,12.6 | U8.43 35.2,7.4 35,7.6 34.8,7.6 v33.8,8.6
  Bottom 0.2: v13.6,12.6 18.8,12.6 21.8,9.6 25.2,9.6 27,11.4 29,11.4 31.8,8.6 v33.8,8.6
PWM2  (via drill 0.25)
  Top 0.2: U2.5 v28.4,12.6 | U8.42 35.6,7.6 v34.6,8.6
  Bottom 0.2: v34.6,8.6 34,9.2 31.8,9.2 v28.4,12.6
PWM3  (via drill 0.25)
  Top 0.2: U3.5 v43.2,12.6 | v35.4,8.6 36,8 U8.41
  Bottom 0.2: v43.2,12.6 41.8,11.2 40.4,9.8 36.6,9.8 v35.4,8.6
PWM4  (via drill 0.25)
  Top 0.2: U4.5 v58,12.6 | v36.2,8.6 36.4,8.4 U8.40
  Bottom 0.2: v58,12.6 55,9.6 45.2,9.6 44.6,10.2 41.4,10.2 40.6,9.4 37,9.4 v36.2,8.6
SCL  (via drill 0.25)
  Top 0.2: TP12.TP v6.4,2.6 | U8.39 36.8,7.8 v37,8 | R14.2 v11.2,3.6 | U6.4 46.05,8.25 v45.8,8 | U5.4 16.45,8.15 v16.6,8
  Bottom 0.2: v6.4,2.6 7.2,3.4 11,3.4 v11.2,3.6 11.6,3.6 16,8 v16.6,8 17.2,8.6 21.8,8.6 22.4,8 v37,8 38.2,8 38.6,8.4 41.8,8.4 42.2,8 v45.8,8
SDA  (via drill 0.25)
  Top 0.2: TP13.TP v8.4,2.6 | U8.38 37.2,7.4 37.4,7.6 38,7.6 v38.2,7.4 | R16.2 v12.4,3.6 | U6.5 47,8.2 v46.8,8 | U5.5 17.4,8.2 v17.6,8
  Bottom 0.2: v8.4,2.6 8.8,3 11.8,3 v12.4,3.6 16.2,7.4 17,7.4 v17.6,8 17.8,8.2 21.6,8.2 22.2,7.6 36.4,7.6 36.6,7.4 v38.2,7.4 38.8,8 41.6,8 42.2,7.4 46.2,7.4 v46.8,8
SW1  (via drill 0.25)
  Top 0.2: U8.7 31.4,3.8 31,3.4 29.8,3.4 v29.6,3.2 | SW1.P$2 17.12,6.67 v17.2,6.6
  Bottom 0.2: v29.6,3.2 26.8,6 17.8,6 v17.2,6.6
SW2  (via drill 0.25)
  Top 0.2: U8.8 31.6,3.4 31.2,3 30.4,3 v30.2,2.8 | SW2.P$2 24.52,6.67 v24.6,6.6
  Bottom 0.2: v30.2,2.8 30.2,3.4 27,6.6 v24.6,6.6
SWDCLK  (via drill 0.25)
  Top 0.2: U8.25 38.6,1.8 v39.2,1.2 | v43.6,0.8 44.2,0.8 TP17.TP
  Bottom 0.2: v39.2,1.2 39.6,0.8 v43.6,0.8
SWDIO  (via drill 0.25)
  Top 0.152: v41.6,1.6 42.2,1.6 TP16.TP
  Top 0.2: U8.26 39,2.2 v39.2,2
  Bottom 0.2: v39.2,2 39.6,1.6 v41.6,1.6
VCC  (via drill 0.25)
  Top 0.2: U7.1 5.45,5.75 5.6,5.6 5.6,4 5.45,3.85 U7.3
  Top 0.5: TP3.TP 3.3,6.1 3.65,5.75 U7.1 4.5,6.47 C40.1
  other vias: 1.8,8.8 7.8,8.6 8.4,8.6 9,10.8 9.6,10.8 10.2,10.8 22.6,8.6 23.2,8.6 25,10.8 24.4,10.8 23.8,10.8 37.4,8.6 38,8.6 39.8,10.8 39.2,10.8 38.6,10.8 52.2,8.6 52.8,8.6 54.6,10.8 54,10.8 53.4,10.8 2.4,8.8 3,8.8 3.6,8.8 1.2,8.8 1.2,9.4 1.8,9.4 2.4,9.4 3,9.4 3.6,9.4
  pour Top (no thermals): 10.4,12 7.6,12 7.6,8.4 10.4,8.4
  pour Top (no thermals): 25.2,12 22.4,12 22.4,8.4 25.2,8.4
  pour Top (no thermals): 40,12 37.2,12 37.2,8.4 40,8.4
  pour Top (no thermals): 54.8,12 52,12 52,8.4 54.8,8.4
  pour Route15: -3,8.2 55.2,8.2 55.2,12.2 -3,12.2
  pour Top (no thermals): 2.4,6 1.2,6 0.8,6.4 0.8,9.6 1,9.8 3.8,9.8 4,9.6 4,7.2 2.8,6
XC1
  Top 0.2: U8.34 39.2,5.4 39.8,6 42.8,6 43.6,5.2 46.3,5.2 Y1.1 48.2,4.22 C24.1
XC2
  Top 0.2: U8.35 39,5.8 39.6,6.4 43,6.4 43.4,6 43.97,6 C25.1 44.98,6.03 Y1.3
XL1
  Top 0.2: U8.2 31.8,5.8 31.4,5.4 31.4,5 30.6,4.2 28,4.2 27.15,5.05 | 27.15,5.05 Y2.P$1 | C26.1 27.38,5.27 27.15,5.05
XL2
  Top 0.2: U8.3 32,5.4 31.8,5.2 31.8,4.8 30.8,3.8 28.4,3.8 27.15,2.55 27,2.55 | 27,2.55 Y2.P$2 | C27.1 27.38,2.17 27,2.55

### Text on the board
_tsilk: FB2019 | spot-power